# Altium schematic sheet MCU_Power.SchDoc
size 420 x 297 mm; DocumentNumber: АЕСН.466369.100Э3; SheetNumber: 7; SheetTotal: x; DocumentName: Sheet1.SCHDOC
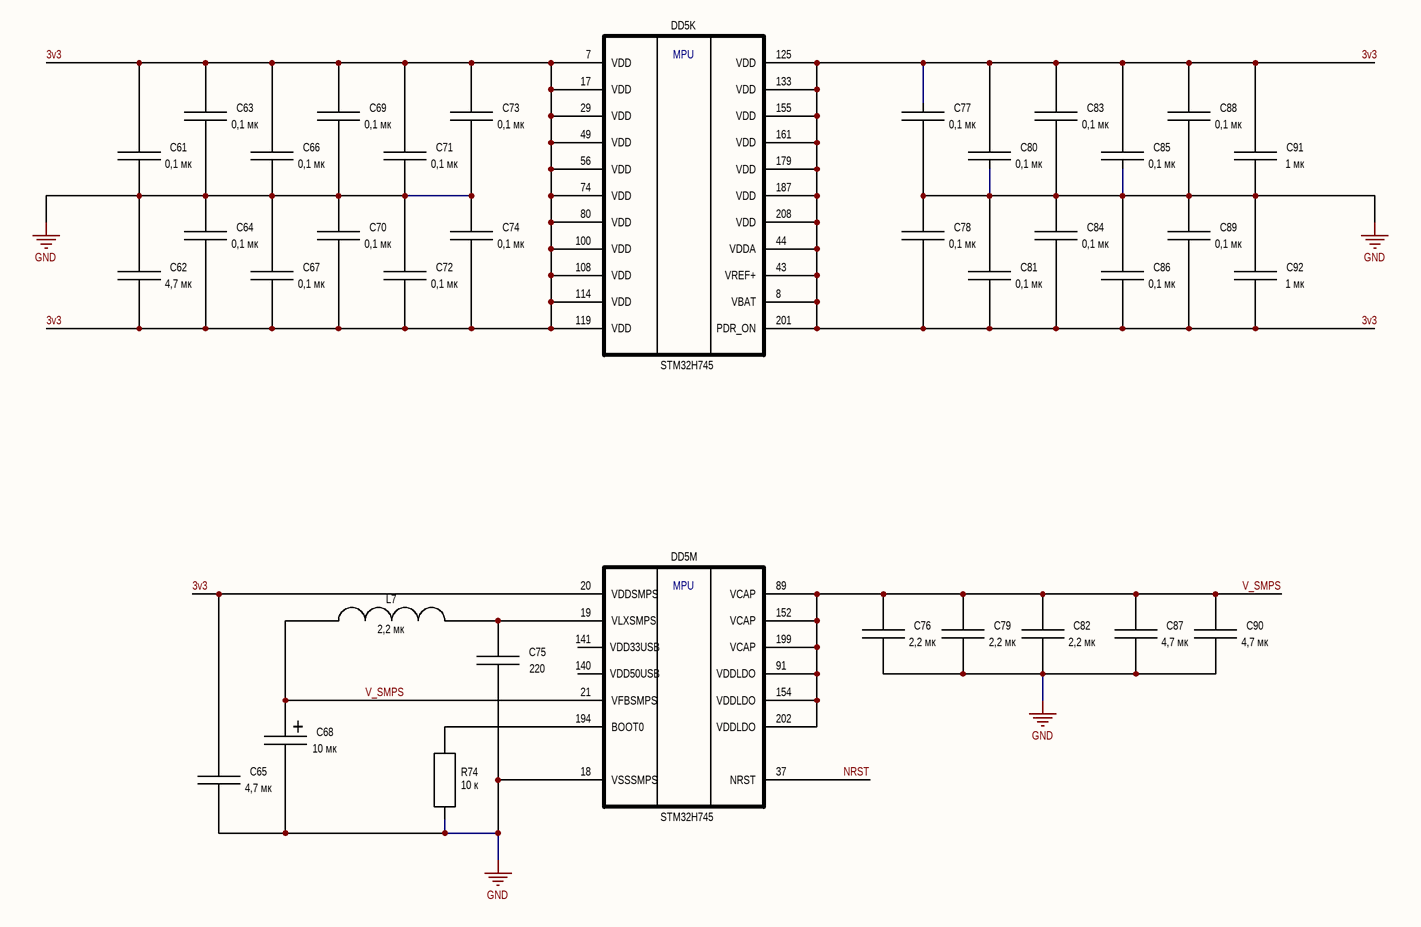
[diagram p0: MCU_Power.SchDoc]

## Parts
C61  value 0,1 мк  [C0603]  (hidden comment: C)
C62  value 4,7 мк  [C0603]  (hidden comment: C)
C63  value 0,1 мк  [C0603]  (hidden comment: C)
C64  value 0,1 мк  [C0603]  (hidden comment: C)
C65  value 4,7 мк  [C0603]  (hidden comment: C)
C66  value 0,1 мк  [C0603]  (hidden comment: C)
C67  value 0,1 мк  [C0603]  (hidden comment: C)
C68  value 10 мк  [Case A]  (hidden comment: C_el)
C69  value 0,1 мк  [C0603]  (hidden comment: C)
C70  value 0,1 мк  [C0603]  (hidden comment: C)
C71  value 0,1 мк  [C0603]  (hidden comment: C)
C72  value 0,1 мк  [C0603]  (hidden comment: C)
C73  value 0,1 мк  [C0603]  (hidden comment: C)
C74  value 0,1 мк  [C0603]  (hidden comment: C)
C75  value 220  [C0603]  (hidden comment: C)
C76  value 2,2 мк  [C0603]  (hidden comment: C)
C77  value 0,1 мк  [C0603]  (hidden comment: C)
C78  value 0,1 мк  [C0603]  (hidden comment: C)
C79  value 2,2 мк  [C0603]  (hidden comment: C)
C80  value 0,1 мк  [C0603]  (hidden comment: C)
C81  value 0,1 мк  [C0603]  (hidden comment: C)
C82  value 2,2 мк  [C0603]  (hidden comment: C)
C83  value 0,1 мк  [C0603]  (hidden comment: C)
C84  value 0,1 мк  [C0603]  (hidden comment: C)
C85  value 0,1 мк  [C0603]  (hidden comment: C)
C86  value 0,1 мк  [C0603]  (hidden comment: C)
C87  value 4,7 мк  [C0603]  (hidden comment: C)
C88  value 0,1 мк  [C0603]  (hidden comment: C)
C89  value 0,1 мк  [C0603]  (hidden comment: C)
C90  value 4,7 мк  [C0603]  (hidden comment: C)
C91  value 1 мк  [C0603]  (hidden comment: C)
C92  value 1 мк  [C0603]  (hidden comment: C)
DD5  STM32H745  [LQFP208]  (parts K,M of 13)
L7  2,2 мк  [INDC_0603]
R74  value 10 к  [R0603]  (hidden comment: R)

## Nets
GND: C61.2 C62.1 C63.2 C64.1 C65.2 C66.2 C67.1 C68.2 C69.2 C70.1 C71.2 C72.1 C73.2 C74.1 C75.2 C76.2 C77.2 C78.1 C79.2 C80.2 C81.1 C82.2 C83.2 C84.1 C85.2 C86.1 C87.2 C88.2 C89.1 C90.2 C91.2 C92.1 DD5.18(VSSSMPS) R74.1
3v3: C61.1 C62.2 C63.1 C64.2 C65.1 C66.1 C67.2 C69.1 C70.2 C71.1 C72.2 C73.1 C74.2 C77.1 C78.2 C80.1 C81.2 C83.1 C84.2 C85.1 C86.2 C88.1 C89.2 C91.1 C92.2 DD5.7(VDD) DD5.8(VBAT) DD5.17(VDD) DD5.20(VDDSMPS) DD5.29(VDD) DD5.43(VREF+) DD5.44(VDDA) DD5.49(VDD) DD5.56(VDD) DD5.74(VDD) DD5.80(VDD) DD5.100(VDD) DD5.108(VDD) DD5.114(VDD) DD5.119(VDD) DD5.125(VDD) DD5.133(VDD) DD5.155(VDD) DD5.161(VDD) DD5.179(VDD) DD5.187(VDD) DD5.201(PDR_ON) DD5.208(VDD)
NRST: DD5.37(NRST)
V_SMPS: C68.1 C76.1 C79.1 C82.1 C87.1 C90.1 DD5.21(VFBSMPS) DD5.89(VCAP) DD5.91(VDDLDO) DD5.152(VCAP) DD5.154(VDDLDO) DD5.199(VCAP) DD5.202(VDDLDO) L7.2
NetC75_1: C75.1 DD5.19(VLXSMPS) L7.1
NetDD5_194: DD5.194(BOOT0) R74.2

Not connected (* = marked no-connect by the designer): DD5 140(VDD50USB) 141(VDD33USB)

## Notes on the sheet
- Подп. и дата
- Инв.№ дубл.
- Взам. инв. №
- Инв № подл.
- Изм.
- Лист
- № докум.
- Подп.
- Дата
- Копировал
- Формат А3
- (in symbol C_el) +
- (in symbol STM32H745, part K) MPU
- (in symbol STM32H745, part M) MPU

## Library data of the parts
C61 C63 C64 C66 C67 C69-C74 C77 C78 C80 C81 C83-C86 C88 C89 = C: PartNumber: GRM188R71H104KA93D; Tolerance: ±10%; Voltage: 50 В; Dielectric: X7R; Case: 0603; Mount: *
C62 C65 C87 C90 = C: PartNumber: GRM188Z71C475KE21D; Tolerance: ±10%; Voltage: 16 В; Dielectric: X7R; Case: 0603; Mount: *
C68 = C_el: PartNumber: TAJA106K016RNJ; Tolerance: ±10%; Voltage: 16 V; Dielectric: *; Case: "A"; Mount: *
C75 = C: PartNumber: GCM1885C2A221JA16D; Tolerance: ±5%; Voltage: 100 В; Dielectric: NP0; Case: 0603; Mount: *
C76 C79 C82 = C: PartNumber: GRM188R71A225KE15J; Tolerance: ±10%; Voltage: 10 В; Dielectric: X7R; Case: 0603; Mount: *
C91 C92 = C: PartNumber: GRM188R71E105KA12D; Tolerance: ±10%; Voltage: 25 В; Dielectric: X7R; Case: 0603; Mount: *
L7 = L_1: PartNumber: MLZ1608A2R2WT000
R74 = R: PartNumber: RC0603JR-0710KL; Tolerance: ±5%; Power: 0.1 Вт; Case: 0603